# Altium schematic sheet AuxilliaryLEDs.SchDoc
size 381 x 241 mm
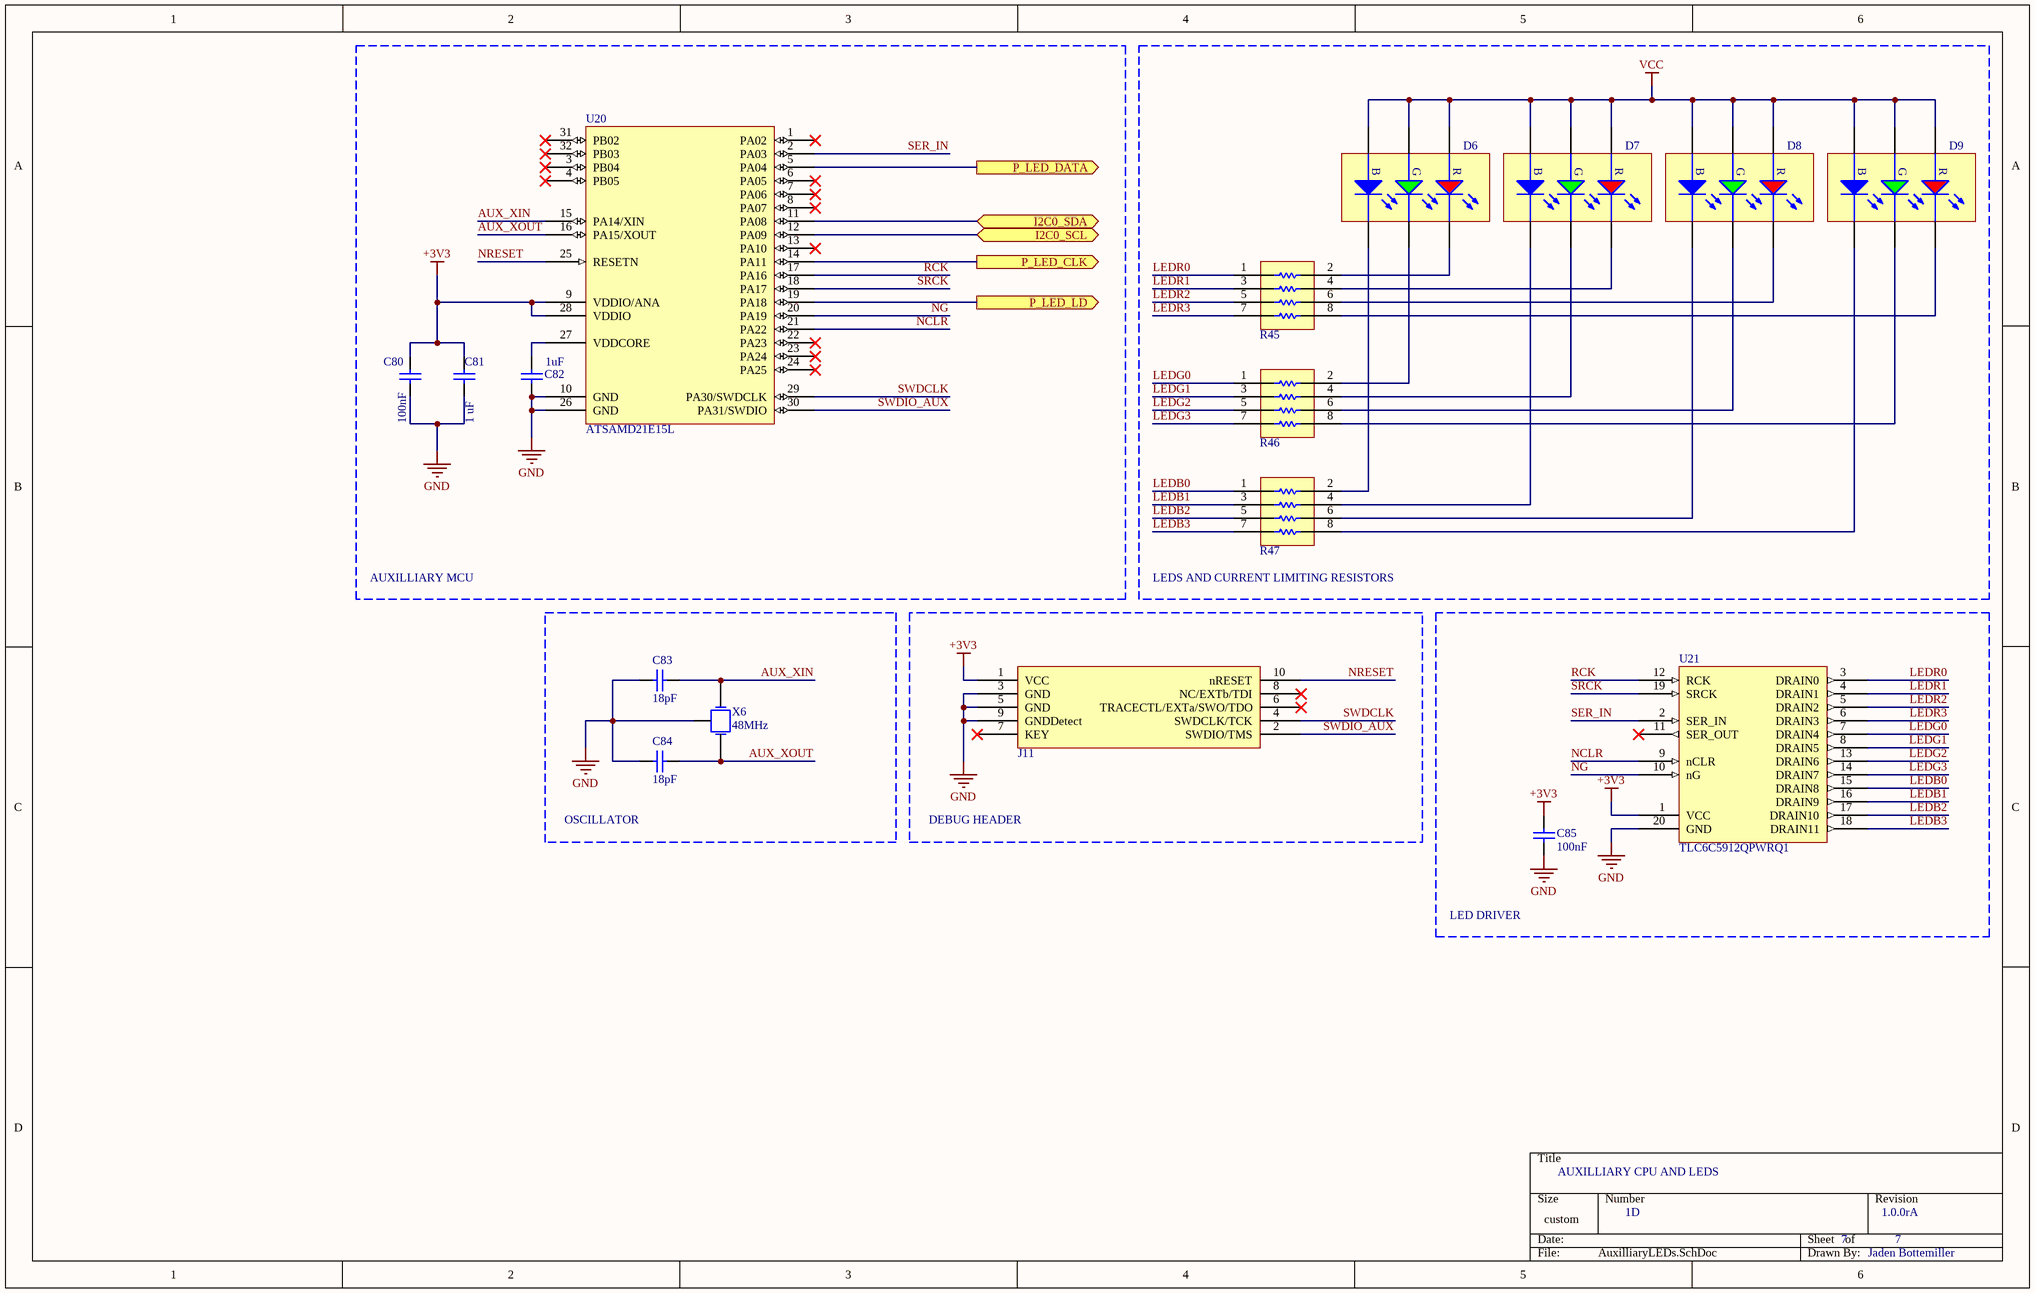
[diagram p0: AuxilliaryLEDs.SchDoc]

## Parts
C80  value 100nF  (hidden comment: CAP)
C81  value 1 uF  (hidden comment: CAP)
C82  value 1uF  (hidden comment: CAP)
C83  value 18pF  (hidden comment: CAP)
C84  value 18pF  (hidden comment: CAP)
C85  value 100nF  (hidden comment: CAP)
D6  RGB LED  (value not drawn)
D7  RGB LED  (value not drawn)
D8  RGB LED  (value not drawn)
D9  RGB LED  (value not drawn)
J11  Debug Connector  (value not drawn)
R45  RESNET  (value not drawn)
R46  RESNET  (value not drawn)
R47  RESNET  (value not drawn)
U20  ATSAMD21E15L
U21  TLC6C5912QPWRQ1
X6  value 48MHz  (hidden comment: Crystal Oscillator)

## Blocks framed on the sheet
AUXILLIARY MCU: C80-C82 U20
LEDS AND CURRENT LIMITING RESISTORS: D6-D9 R45-R47
OSCILLATOR: C83 C84 X6
DEBUG HEADER: J11
LED DRIVER: C85 U21

## Ports
I2C0_SCL (bidir), I2C0_SDA (bidir), P_LED_CLK (out), P_LED_DATA (out), P_LED_LD (out)

## Nets
+3V3: C80.2 C81.2 C85.2 J11.1(VCC) U20.9(VDDIO/ANA) U20.28(VDDIO) U21.1(VCC)
GND: C80.1 C81.1 C82.1 C83.2 C84.2 C85.1 J11.3(GND) J11.5(GND) J11.9(GNDDetect) U20.10(GND) U20.26(GND) U21.20(GND) X6.3(GND)
VCC: D6.4(RA) D6.5(GA) D6.6(BA) D7.4(RA) D7.5(GA) D7.6(BA) D8.4(RA) D8.5(GA) D8.6(BA) D9.4(RA) D9.5(GA) D9.6(BA)
AUX_XIN: C83.1 U20.15(PA14/XIN) X6.1(X1)
AUX_XOUT: C84.1 U20.16(PA15/XOUT) X6.2(X2)
I2C0_SCL: U20.12(PA09) ; port I2C0_SCL
I2C0_SDA: U20.11(PA08) ; port I2C0_SDA
LEDB0: R47.1(Pin) U21.15(DRAIN8)
LEDB1: R47.3(Pin) U21.16(DRAIN9)
LEDB2: R47.5(Pin) U21.17(DRAIN10)
LEDB3: R47.7(Pin) U21.18(DRAIN11)
LEDG0: R46.1(Pin) U21.7(DRAIN4)
LEDG1: R46.3(Pin) U21.8(DRAIN5)
LEDG2: R46.5(Pin) U21.13(DRAIN6)
LEDG3: R46.7(Pin) U21.14(DRAIN7)
LEDR0: R45.1(Pin) U21.3(DRAIN0)
LEDR1: R45.3(Pin) U21.4(DRAIN1)
LEDR2: R45.5(Pin) U21.5(DRAIN2)
LEDR3: R45.7(Pin) U21.6(DRAIN3)
NCLR: U20.21(PA22) U21.9(nCLR)
NG: U20.20(PA19) U21.10(nG)
NRESET: J11.10(nRESET) U20.25(RESETN)
P_LED_CLK: U20.14(PA11) ; port P_LED_CLK
P_LED_DATA: U20.5(PA04) ; port P_LED_DATA
P_LED_LD: U20.19(PA18) ; port P_LED_LD
RCK: U20.17(PA16) U21.12(RCK)
SER_IN: U20.2(PA03) U21.2(SER_IN)
SRCK: U20.18(PA17) U21.19(SRCK)
SWDCLK: J11.4(SWDCLK/TCK) U20.29(PA30/SWDCLK)
SWDIO_AUX: J11.2(SWDIO/TMS) U20.30(PA31/SWDIO)
NetC82_2: C82.2 U20.27(VDDCORE)
NetD6_1: D6.1(BC) R47.2(Pin)
NetD6_2: D6.2(GC) R46.2(Pin)
NetD6_3: D6.3(RC) R45.2(Pin)
NetD7_1: D7.1(BC) R47.4(Pin)
NetD7_2: D7.2(GC) R46.4(Pin)
NetD7_3: D7.3(RC) R45.4(Pin)
NetD8_1: D8.1(BC) R47.6(Pin)
NetD8_2: D8.2(GC) R46.6(Pin)
NetD8_3: D8.3(RC) R45.6(Pin)
NetD9_1: D9.1(BC) R47.8(Pin)
NetD9_2: D9.2(GC) R46.8(Pin)
NetD9_3: D9.3(RC) R45.8(Pin)

Not connected (* = marked no-connect by the designer): J11 6(TRACECTL/EXTa/SWO/TDO)* 7(KEY)* 8(NC/EXTb/TDI)*; U20 1(PA02)* 3(PB04)* 4(PB05)* 6(PA05)* 7(PA06)* 8(PA07)* 13(PA10)* 22(PA23)* 23(PA24)* 24(PA25)* 31(PB02)* 32(PB03)*; U21 11(SER_OUT)*

## Notes on the sheet
- AUXILLIARY CPU AND LEDS
- 1D
- 7
- 1.0.0rA
- Jaden Bottemiller
- (in symbol RGB_LED) B; G; R

## Library data of the parts
C80-C85 = CAP: Standard Capacitor
D6-D9 = RGB_LED: 3-Channel LED (RGB)
J11 = Cortex-M Debug: 10-Pin Cortex-M Debug Connector
R45-R47 = RESNET4: Standard Resistor Network with 4 Resistors
U20 = ATSAMD21E15L: ARM® Cortex®-M0+ SAM D21E Microcontroller IC 32-Bit 48MHz 32KB (32K x 8) FLASH; ComponentLink1Description: DigiKey; ComponentLink1URL: https://www.digikey.com/product-detail/en/microchip-technology/ATSAMD21E15L-MNT/1611-ATSAMD21E15L-MNTCT-ND/6832783; ComponentLink2Description: Datasheet; ComponentLink2URL: http://ww1.microchip.com/downloads/en/DeviceDoc/SAMD21-Family-DataSheet-DS40001882D.pdf
U21 = TLC6C5912QPWRQ1: LED Driver IC 12 Output Linear Shift Register 50mA; ComponentLink1Description: DigiKey; ComponentLink1URL: https://www.digikey.com/product-detail/en/texas-instruments/TLC6C5912QPWRQ1/296-39249-1-ND/5143241; ComponentLink2Description: Datasheet; ComponentLink2URL: http://www.ti.com/lit/ds/symlink/tlc6c5912-q1.pdf
X6 = OSC_1GND: Standard Crystal Oscillator with a ground connection.